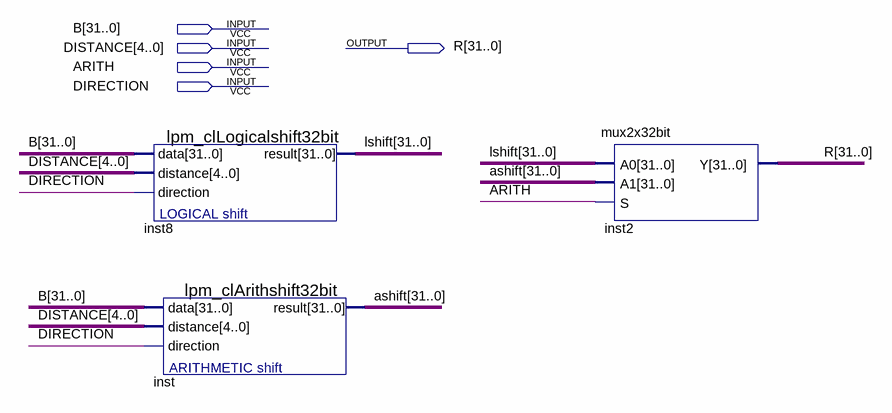
[diagram p0: schematic sheet]
// Quartus schematic ALSHIFT.bdf as structural Verilog: 3 symbols, 5 pins
module ALSHIFT (
  input  [31:0] B,
  input  [4:0] DISTANCE,
  input  ARITH,
  input  DIRECTION,
  output [31:0] R
);

  wire [31:0] ashift, lshift;

  lpm_clLogicalshift32bit inst8 (.data(B), .distance(DISTANCE), .direction(DIRECTION), .result(lshift));
  lpm_clArithshift32bit inst (.data(B), .distance(DISTANCE), .direction(DIRECTION), .result(ashift));
  mux2x32bit inst2 (.A0(lshift), .A1(ashift), .S(ARITH), .Y(R));
endmodule
